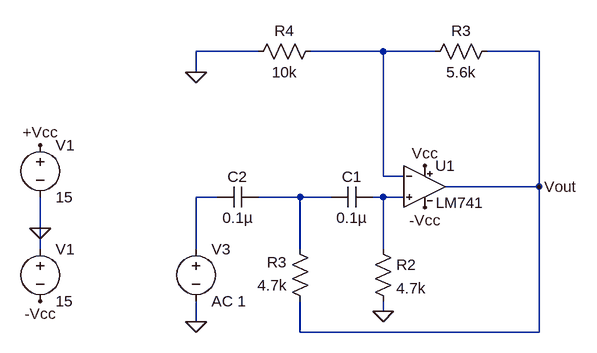
[diagram p0: schematic Draft1.asc]
Draft1.asc, the LTspice schematic file:
Version 4
SHEET 1 880 680
WIRE 112 -80 16 -80
WIRE 304 -80 192 -80
WIRE 384 -80 304 -80
WIRE 544 -80 464 -80
WIRE 16 -48 16 -80
WIRE 304 112 304 -80
WIRE 336 112 304 112
WIRE 544 128 544 -80
WIRE 544 128 400 128
WIRE 48 144 16 144
WIRE 176 144 112 144
WIRE 224 144 176 144
WIRE 304 144 288 144
WIRE 336 144 304 144
WIRE -224 192 -224 144
WIRE -224 224 -224 192
WIRE 16 224 16 144
WIRE 176 224 176 144
WIRE 304 224 304 144
WIRE 304 320 304 304
WIRE 16 336 16 304
WIRE 176 352 176 304
WIRE 544 352 544 128
WIRE 544 352 176 352
FLAG -224 192 0
FLAG -224 64 +Vcc
FLAG -224 304 -Vcc
FLAG 16 336 0
FLAG 304 320 0
FLAG 16 -48 0
FLAG 368 96 Vcc
FLAG 368 160 -Vcc
FLAG 544 128 Vout
SYMBOL LM741 368 64 R0
SYMATTR InstName U1
SYMBOL voltage -224 208 R0
WINDOW 123 0 0 Left 0
WINDOW 39 0 0 Left 0
SYMATTR InstName V1
SYMATTR Value 15
SYMBOL voltage -224 48 R0
WINDOW 123 0 0 Left 0
WINDOW 39 0 0 Left 0
SYMATTR InstName V1
SYMATTR Value 15
SYMBOL voltage 16 208 R0
WINDOW 123 0 0 Left 0
WINDOW 39 0 0 Left 0
SYMATTR InstName V3
SYMATTR Value AC 1
SYMBOL cap 112 128 R90
WINDOW 0 0 32 VBottom 2
WINDOW 3 32 32 VTop 2
SYMATTR InstName C2
SYMATTR Value 0.1µ
SYMBOL cap 288 128 R90
WINDOW 0 0 32 VBottom 2
WINDOW 3 32 32 VTop 2
SYMATTR InstName C1
SYMATTR Value 0.1µ
SYMBOL res 192 320 R180
WINDOW 0 36 76 Left 2
WINDOW 3 36 40 Left 2
SYMATTR InstName R3
SYMATTR Value 4.7k
SYMBOL res 288 208 R0
WINDOW 0 36 40 Left 2
WINDOW 3 36 76 Left 2
SYMATTR InstName R2
SYMATTR Value 4.7k
SYMBOL res 480 -96 R90
WINDOW 0 0 56 VBottom 2
WINDOW 3 32 56 VTop 2
SYMATTR InstName R3
SYMATTR Value 5.6k
SYMBOL res 208 -96 R90
WINDOW 0 0 56 VBottom 2
WINDOW 3 32 56 VTop 2
SYMATTR InstName R4
SYMATTR Value 10k

The netlist it stands for:
* Draft1.asc
XU1 N004 N001 Vcc -Vcc Vout LM741  ; pins In+ In- V+ V- OUT
V1 0 -Vcc 15
V1 +Vcc 0 15
V3 N002 0 AC 1
C2 N003 N002 0.1µ
C1 N004 N003 0.1µ
R3 Vout N003 4.7k
R2 N004 0 4.7k
R3 Vout N001 5.6k
R4 N001 0 10k
.lib LM741.lib
.backanno
.end